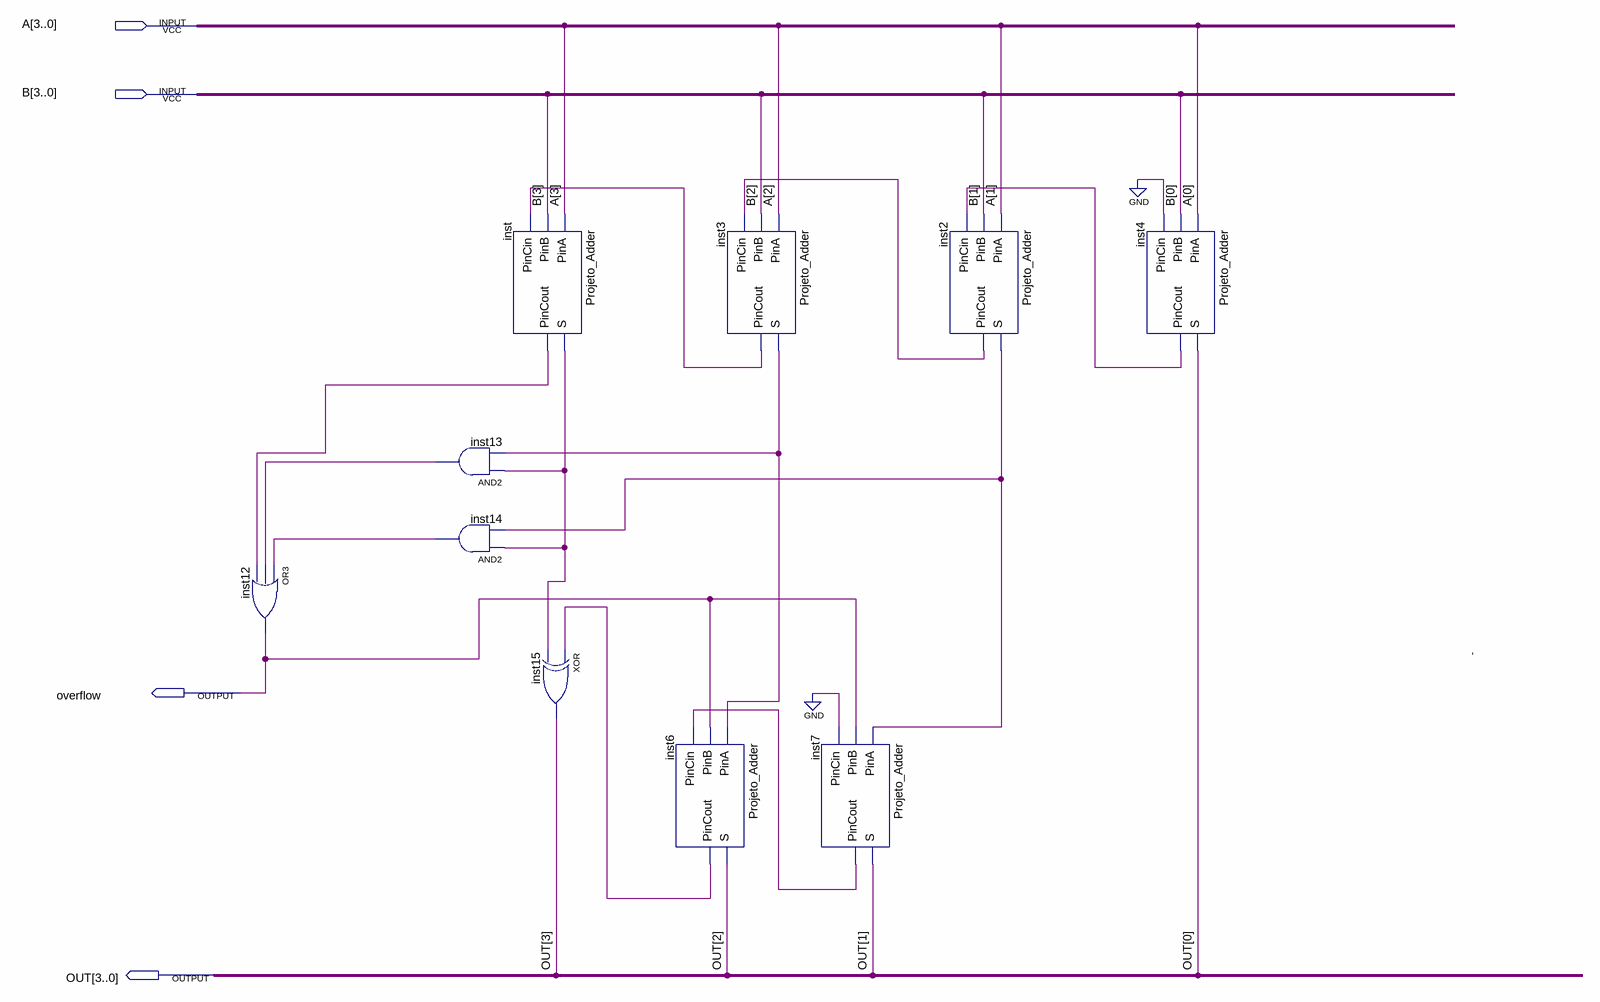
[diagram p0: schematic sheet]
// Quartus schematic Somador_BCD.bdf as structural Verilog: 10 symbols, 4 pins
module Somador_BCD (
  input  [3:0] A,
  input  [3:0] B,
  output overflow,
  output [3:0] OUT
);

  wire inst2_pincout, inst2_s, inst3_pincout, inst3_s, inst4_pincout, inst6_pincout, inst7_pincout,
       inst13_out, inst14_out, inst_pincout, inst_s;

  or inst12 (overflow, inst14_out, inst13_out, inst_pincout);
  and inst13 (inst13_out, inst_s, inst3_s);
  and inst14 (inst14_out, inst_s, inst2_s);
  Projeto_Adder inst (.PinA(A[3]), .PinB(B[3]), .PinCin(inst3_pincout), .S(inst_s), .PinCout(inst_pincout));
  xor inst15 (OUT[3], inst6_pincout, inst_s);
  Projeto_Adder inst6 (.PinA(inst3_s), .PinB(overflow), .PinCin(inst7_pincout), .S(OUT[2]), .PinCout(inst6_pincout));
  Projeto_Adder inst3 (.PinA(A[2]), .PinB(B[2]), .PinCin(inst2_pincout), .S(inst3_s), .PinCout(inst3_pincout));
  Projeto_Adder inst7 (.PinA(inst2_s), .PinB(overflow), .PinCin(1'b0), .S(OUT[1]), .PinCout(inst7_pincout));
  Projeto_Adder inst2 (.PinA(A[1]), .PinB(B[1]), .PinCin(inst4_pincout), .S(inst2_s), .PinCout(inst2_pincout));
  Projeto_Adder inst4 (.PinA(A[0]), .PinB(B[0]), .PinCin(1'b0), .S(OUT[0]), .PinCout(inst4_pincout));

  // Notes on the sheet:
  //   '
endmodule
